# EAGLE design STM8L-FOX_80m_PA_V5_3 (EAGLE 7.7.0)
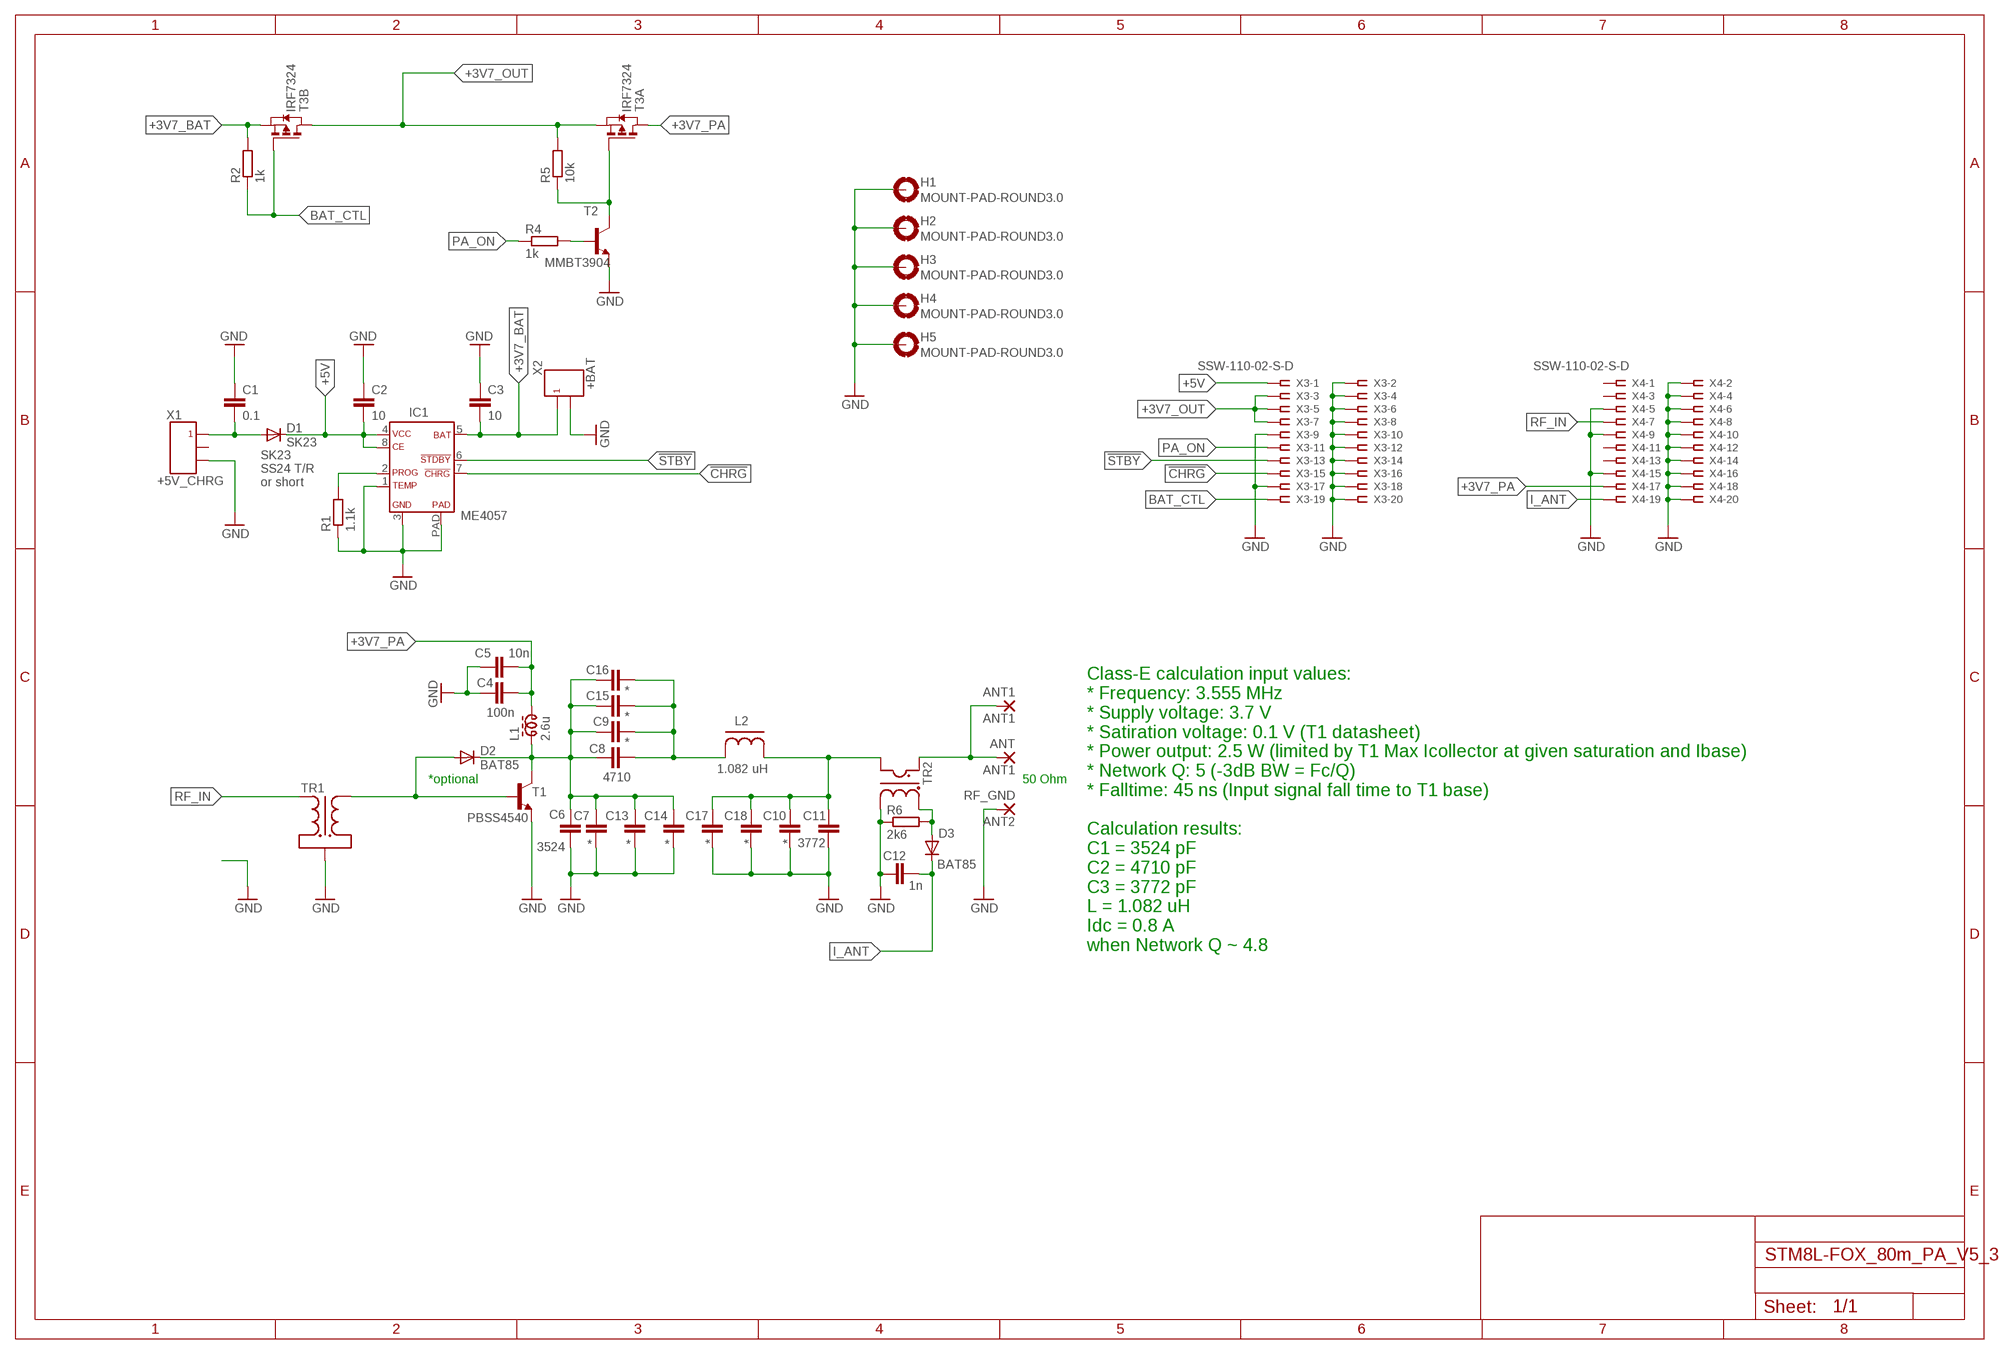
[diagram p0: schematic, sheet 1]

## Parts
ANT  ANT1  WIREPAD2,54/0,8  [2,54/0,8]
ANT1  ANT1  WIREPAD2,54/0,8  [2,54/0,8]
C1  0.1  C-EUC1206K  [C1206K]
C2  10  C-EUC1206K  [C1206K]
C3  10  C-EUC1206K  [C1206K]
C4  100n  C-EUC1206K  [C1206K]
C5  10n  C-EUC1206K  [C1206K]
C6  3524  C-EUC1206K  [C1206K]
C7  *  C-EUC1206K  [C1206K]
C8  4710  C-EUC1206K  [C1206K]
C9  *  C-EUC1206K  [C1206K]
C10  *  C-EUC1206K  [C1206K]
C11  3772  C-EUC1206K  [C1206K]
C12  1n  C-EUC1206K  [C1206K]
C13  *  C-EUC1206K  [C1206K]
C14  *  C-EUC1206K  [C1206K]
C15  *  C-EUC1206K  [C1206K]
C16  *  C-EUC1206K  [C1206K]
C17  *  C-EUC1206K  [C1206K]
C18  *  C-EUC1206K  [C1206K]
D1  SK23  DIODE-DO-214AC  [DO-214AC]
D2  BAT85  BAT81  [DO34-7]
D3  BAT85  BAT81  [DO34-7]
H1  MOUNT-PAD-ROUND3.0  [3,0-PAD]
H2  MOUNT-PAD-ROUND3.0  [3,0-PAD]
H3  MOUNT-PAD-ROUND3.0  [3,0-PAD]
H4  MOUNT-PAD-ROUND3.0  [3,0-PAD]
H5  MOUNT-PAD-ROUND3.0  [3,0-PAD]
IC1  ME4057A  ME4057  [SOP08-PP]
L1  2.6u  ZD60820513  [ZD6-3W]
L2  1.082 uH  T68_COIL  [T68_COIL]
R1  1.1k  R-EU_R1206  [R1206]
R2  1k  R-EU_R1206  [R1206]
R4  1k  R-EU_R1206  [R1206]
R5  10k  R-EU_R1206  [R1206]
R6  2k6  R-EU_R1206  [R1206]
RF_GND  ANT2  WIREPAD2,54/0,8  [2,54/0,8]
T1  PBSS4540  [SOT223]
T2  MMBT3904  MMBT3904LT1-NPN-SOT23-BEC  [SOT23-BEC]
T3  IRF7324  PMOS2SO8  [SO8]
TR1  K7X4X2_TRANS_1V1  [K7X4X2_TRANS_1V1]
TR2  K7X4X2_TRANS_CURRENT  [K7X4X2_TRANS_CURRENT]
X1  +5V_CHRG  A2501WR-3P  [A2501WR-3P]
X2  +BAT  A2501WR-2P  [A2501WR-2P]
X3  SSW-110-02-S-D  [SSW-110-02-S-D]
X4  SSW-110-02-S-D  [SSW-110-02-S-D]

## Nets
!CHRG!: IC1.7 X3.15
!STBY!: IC1.6 X3.13
+3V7_BAT: C3.2 IC1.5 R2.2 T3.3(B:S) X2.P$1
+3V7_OUT: R5.2 T3.1(A:S) T3.5(B:D) T3.6(B:D) X3.3 X3.5 X3.7
+3V7_PA: C4.2 C5.1 L1.2 T3.7(A:D) T3.8(A:D) X4.17
+5V: C2.2 D1.C IC1.4 IC1.8 X3.1
BAT_CTL: R2.1 T3.4(B:G) X3.19
CHRGR: C1.2 D1.A X1.P$1
GND: C1.1 C2.1 C3.1 C4.1 C5.2 C6.2 C7.2 C10.2 C11.2 C12.1 C13.2 C14.2 C17.2 C18.2 H1.B3,0(MOUNT) H2.B3,0(MOUNT) H3.B3,0(MOUNT) H4.B3,0(MOUNT) H5.B3,0(MOUNT) IC1.1 IC1.3 IC1.PAD R1.1 R6.1 RF_GND.1(P) T1.3(E) T2.E TR1.P$1 TR2.P$4 X1.P$3 X2.P$2 X3.2 X3.4 X3.6 X3.8 X3.9 X3.10 X3.12 X3.14 X3.16 X3.17 X3.18 X3.20 X4.2 X4.4 X4.5 X4.6 X4.8 X4.9 X4.10 X4.12 X4.14 X4.15 X4.16 X4.18 X4.20
I_ANT: C12.2 D3.C X4.19
N$1: D2.A T1.1(B) TR1.P$3
N$2: R5.1 T2.C T3.2(A:G)
N$3: C8.2 C9.2 C15.2 C16.2 L2.P$1
N$4: IC1.2 R1.2
N$5: R4.2 T2.B
N$7: C6.1 C7.1 C8.1 C9.1 C13.1 C14.1 C15.1 C16.1 D2.C L1.1 T1.2(C) T1.4(C)
N$8: C10.1 C11.1 C17.1 C18.1 L2.P$2 TR2.P$2
N$9: ANT1.1(P) ANT.1(P) TR2.P$1
N$11: D3.A R6.2 TR2.P$3
PA_ON: R4.1 X3.11
RF_IN: TR1.P$2 X4.7
Unconnected: L2.P$3 L2.P$4 TR1.P$4 TR1.P$5 X1.P$2 X4.1 X4.3 X4.11 X4.13

## Notes on the sheet
- SK23
  SS24 T/R
  or short
- *optional | 50 Ohm
- Class-E calculation input values:
  * Frequency: 3.555 MHz
  * Supply voltage: 3.7 V
  * Satiration voltage: 0.1 V (T1 datasheet)
  * Power output: 2.5 W (limited by T1 Max Icollector at given saturation and Ibase)
  * Network Q: 5 (-3dB BW = Fc/Q)
  * Falltime: 45 ns (Input signal fall time to T1 base)
  
  Calculation results:
  C1 = 3524 pF
  C2 = 4710 pF
  C3 = 3772 pF
  L = 1.082 uH
  Idc = 0.8 A
  when Network Q ~ 4.8

## Library data of the parts
ANT ANT1 RF_GND = wirepad:WIREPAD: Wire PAD connect wire on PCB
C1-C18 = rcl:C-EU: CAPACITOR, European symbol
D1 = diode:DIODE-: DIODE
D2 D3 = diode:BAT81: DIODE barrier diode
H1-H5 = holes:MOUNT-PAD-ROUND: MOUNTING PAD, round
IC1 = pa-ind:ME4057: ME4057 single cell LiPo charger
L1 = inductor-neosid:ZD60820513: WIDE-BAND CHOKE 3 windings; OC_FARNELL: unknown; OC_NEWARK: unknown
L2 = pa-ind:T68_COIL: Amidon T68 coil
R1 R2 R4-R6 = rcl:R-EU_: RESISTOR, European symbol
T1 = pa-ind:PBSS4540: PBSS4540 NPN BISS transistor SOT223
T2 = transistor:*-NPN-: NPN Transistror BF959 corrected 2008.03.06
T3 = zetex:PMOS2: DUAL 30V P-CHANNEL ENHANCEMENT MODE MOSFET Source: Data sheet <http://www.diodes.com/datasheets/ZXMP3A16DN8.pdf> SOP8 Source: Data sheet <http://www.diodes.com/datasheets/ZXMD63P03X.pdf> MSOP8; OC_FARNELL: unknown; OC_NEWARK: unknown
TR1 = pa-ind:K7X4X2_TRANS_1V1: K7x4x2 1:1 transformer
TR2 = pa-ind:K7X4X2_TRANS_CURRENT: K7x4x2 current transformer
X1 = pa-ind:A2501WR-3P: Joint Tech A2501 Series 3-pin 2.5 mm right angle through hole header.
X2 = pa-ind:A2501WR-2P
X3 X4 = con-samtec:SSW-110-02-S-D: THROUGH-HOLE .025" SQ POST SOCKET Source: Samtec SSW.pdf; MPN: SSW-110-02-S-D; OC_FARNELL: unknown; OC_NEWARK: 11P9480

## Board
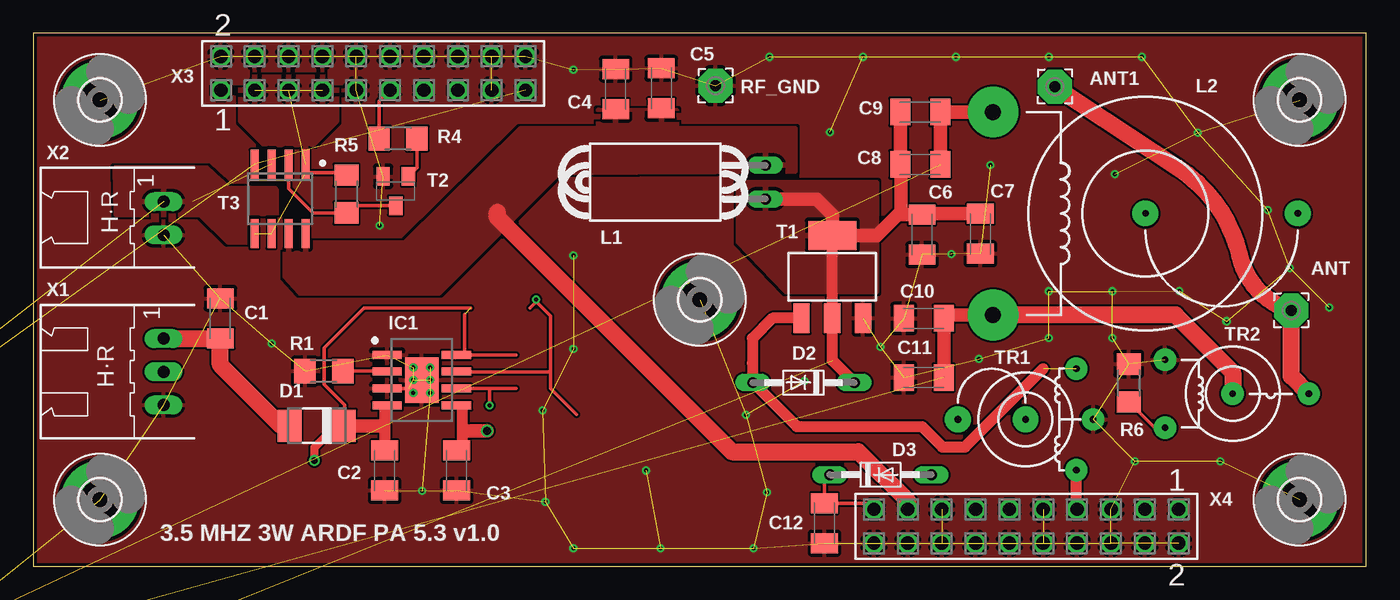
[diagram p1: board, top side]
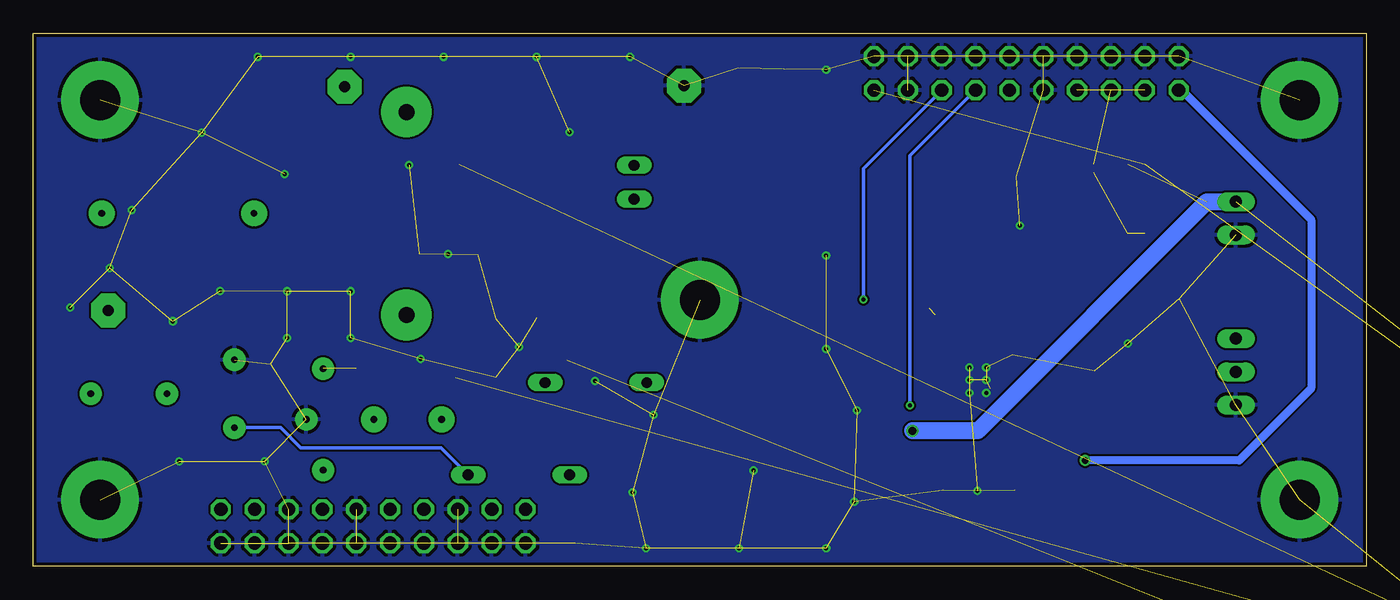
[diagram p2: board, bottom side, seen from below]

Size 100 x 40 mm. Coordinates in mm from the lower left corner, seen from the top.
Outline: 0,0 100,0 100,40 0,40 0,0
Copper layers (1*16): Top 0.035mm / dielectric 1.5mm / Bottom 0.035mm
Design rules "SeeedStudio_2layer_DRU_no_angle_20140221 *": minimum track width 6mil, minimum drill 0.29971875mm, track to track 6mil, track to pad 6mil, pad to pad 6mil, via to via 6mil, smd to smd 0mil, copper to edge 10mil, drill to drill 10mil, minimum pad ring 10mil, minimum via ring 6mil, stop-mask expansion 2mil, vias tented up to drill 100mil, thermal gap 10mil

### Footprints (pad centres in the part's own frame; a part is rotated, then mirrored left to right if it is on the bottom)
2,54/0,8 = drill 0.813 pad 2.54 octagon: 1 0,0
C1206K = smd 1.5 x 2: 1 -1.5,0; 2 1.5,0
DO-214AC = smd 1.8 x 2.4: A 2.025,0; C -2.025,0
DO34-7 = drill 0.813 long: A 3.81,0; C -3.81,0
3,0-PAD = drill 3 pad 5.842: B3,0 0,0
SOP08-PP = smd 0.6 x 2.2: 1 -1.905,-2.6; 2 -0.635,-2.6; 3 0.635,-2.6; 4 1.905,-2.6; 5 1.905,2.6; 6 0.635,2.6; 7 -0.635,2.6; 8 -1.905,2.6 | smd 3.404 x 2.515: PAD 0,0
ZD6-3W = drill 0.8 long: 1 -8.255,1.27; 2 -8.255,-1.27
T68_COIL = drill 1.2 pad 3.81: P$1 -7.62,-11.43; P$2 7.62,-11.43 | drill 0.5 pad 1.93: P$3 0,0; P$4 0,11.43
R1206 = smd 1.6 x 1.803: 1 -1.422,0; 2 1.422,0
SOT223 = smd 1.219 x 2.235: 1 -2.311,-3.099; 2 0,-3.099; 3 2.311,-3.099 | smd 3.6 x 2.2: 4 0,3.099
SOT23-BEC = smd 1 x 1.4: B -0.95,-1.1; C 0,1.1; E 0.95,-1.1
SO8 = smd 0.6 x 2.2: 1 -1.905,-2.6; 2 -0.635,-2.6; 3 0.635,-2.6; 4 1.905,-2.6; 5 1.905,2.6; 6 0.635,2.6; 7 -0.635,2.6; 8 -1.905,2.6
K7X4X2_TRANS_1V1 = drill 0.5 pad 1.676: P$1 0,-5.08; P$2 -3.81,-3.81; P$3 3.81,-3.81 | drill 0.5 pad 1.93: P$4 0,0; P$5 0,5.08
K7X4X2_TRANS_CURRENT = drill 0.5 pad 1.676: P$1 0,5.715; P$2 0,0; P$3 2.54,-5.08; P$4 -2.54,-5.08
A2501WR-3P = drill 0.9 long: P$1 7.5,2.3; P$2 5,2.3; P$3 2.5,2.3
A2501WR-2P = drill 0.9 long: P$1 4.95,2.3; P$2 2.45,2.3
SSW-110-02-S-D = drill 1 pad 1.5 octagon: 1 -11.43,-1.27; 2 -11.43,1.27; 3 -8.89,-1.27; 4 -8.89,1.27; 5 -6.35,-1.27; 6 -6.35,1.27; 7 -3.81,-1.27; 8 -3.81,1.27; 9 -1.27,-1.27; 10 -1.27,1.27; 11 1.27,-1.27; 12 1.27,1.27; 13 3.81,-1.27; 14 3.81,1.27; 15 6.35,-1.27; 16 6.35,1.27; 17 8.89,-1.27; 18 8.89,1.27; 19 11.43,-1.27; 20 11.43,1.27

### Placement (x,y rotation side)
ANT  94.37,19.2 0 top
ANT1  76.65,36 0 top
C1  14.03,18.61 270 top
C2  26.35,7.18 90 top
C3  31.75,7.18 90 top
C4  43.69,35.81 270 top
C5  47.12,35.88 90 top
C6  66.67,24.89 270 top
C7  71.06,24.96 270 top
C8  66.55,30.16 0 top
C9  66.55,34.1 0 top
C10  66.8,18.61 180 top
C11  66.8,14.16 180 top
C12  59.35,3.24 90 top
C13  -28.6,-20.85 0 top  (outside the outline)
C14  -35.3,-20.85 0 top  (outside the outline)
C15  -42,-20.85 0 top  (outside the outline)
C16  -48.7,-20.85 0 top  (outside the outline)
C17  -55.4,-20.85 0 top  (outside the outline)
C18  -62.1,-20.85 0 top  (outside the outline)
D1  21.27,10.54 180 top
D2  57.78,13.78 180 top
D3  63.57,6.87 0 top
H1  5,35 0 top
H2  95,35 0 top
H3  5,5 0 top
H4  95,5 0 top
H5  50,20 0 top
IC1  29.15,13.97 270 top
L1  46.67,28.83 180 top
L2  83.44,26.48 270 top
R1  21.8,14.64 0 top
R2  -61.9,-27.25 0 top  (outside the outline)
R4  27.36,32.1 0 top
R5  23.5,27.94 90 top
R6  82.19,13.75 270 top
RF_GND  51.18,36.07 0 top
T1  59.94,21.72 0 top
T2  27.19,28.16 180 top
T3  18.51,27.56 180 top
TR1  74.44,11.02 90 top
TR2  89.98,12.95 270 top
X1  12.06,9.59 90 top
X2  12.06,22.42 90 top
X3  25.5,37 0 top
X4  74.5,3 180 top

### Tracks (layer width: path | path; a pad name or v marks a point on that pad's centre or on a via)
!CHRG!  (via drill 0.3)
  Top 0.254: IC1.7 38.8,14.6 | 37.27,19.37 37.72,19.82 v37.72,20.01 37.72,19.88 38.8,18.8 38.8,14.6 | 40.75,11.4 38.8,13.35 38.8,14.6
  Bottom 0.254: X3.15 37.72,29.86 v37.72,20.01
!STBY!  (via drill 0.3)
  Top 0.254: IC1.6 34.2,13.34 | 34.2,13.34 36.23,13.34 | v34.23,12.06 34.23,13.31 34.2,13.34
  Bottom 0.254: v34.23,12.06 34.23,30.81 X3.13
+3V7_BAT  (via drill 0.6)  (2 unrouted)
  Top 0.254: 32.19,11.75 31.88,12.06 IC1.5 | 32.7,10.16 32.19,10.16
  Top 0.813: C3.2 32.19,9.13 32.19,10.16 32.19,11.75
  Top 1.016: v34.04,10.16 32.7,10.16
  Bottom 1.27: v34.04,10.16 29.15,10.16 11.94,27.37 X2.P$1
  pour Top (isolate 0.254): 18.2,28.25 18.2,24.3 14.65,24.35 12.55,26.4 6.2,26.4 6.15,29.9 13,29.9 14.05,28.9 14.6,28.35 18.15,28.35
+3V7_OUT  (5 unrouted)
  Top 0.254: R5.2 23.31,29.55 20.45,29.55 20.45,30.13 T3.1
  pour Top (isolate 0.254): 15.55,36.7 15.55,33.45 17.5,31.5 17.5,30.75 20.8,30.75 20.8,31.5 22.75,33.45 22.75,36.7
+3V7_PA
  Top 1.27: X4.17 65.61,4.89 61.9,8.6 52.4,8.6 34.8,26.2 34.8,26.55
  pour Top (isolate 0.254): 18.9,24.25 27.9,24.25 36.6,32.85 42.4,32.85 42.4,34.25 48.25,34.2 48.25,32.85 57.15,32.85 57.15,29.65 39.4,29.55 30.4,20.5 20,20.5 18.9,21.75
+5V  (via drill 0.5)  (1 unrouted)
  Top 0.254: 26.38,11.89 IC1.4 | 26.25,10.54 26.38,10.54 | IC1.8 32.35,15.88 | 32.35,15.88 36.23,15.88 | 32.35,18.91 32.35,15.88 | 32.81,19.4 24.8,19.4 21.8,16.4 21.8,13.65 23.35,12.1 23.35,10.85 23.3,10.85 D1.C
  Top 0.406: 26.38,8.7 C2.2
  Top 0.61: v21.08,7.94 21.08,8.89 22.73,10.54 D1.C
  Top 0.813: 26.38,8.7 26.38,10.54 26.38,11.89
  Top 1.016: D1.C 26.25,10.54
  Bottom 0.61: v21.08,7.94 9.53,7.94 4.13,13.34 4.13,26.04 13.82,35.73 X3.1
BAT_CTL  (2 unrouted)
CHRGR
  Top 1.27: X1.P$1 9.78,17.11 C1.2 14.03,15.11 18.61,10.54 D1.A
GND  (via drill 0.3)  (98 unrouted)
  Top 0.254: IC1.3 28.19,13.34 v28.51,13.02
  other vias: 28.51,14.92 28.51,13.97 29.78,14.92 29.78,13.97 29.78,13.02 38.2,11.71 40.51,37.27 40.51,23.3 40.51,16.32 38.41,4.83 59.75,32.58 53.47,11.37 57.85,13.91 68.9,23.43 63.56,16.45 45.97,7.18 25.98,25.57 55.04,5.55 17.89,16.71 71.82,30.1 76.2,20.64 80.96,20.64 89.53,18.39 70.93,15.56 82.64,7.85 76.2,17.14 80.96,17.14 89.05,7.86 85.97,20.64 29.16,5.64 97.24,19.43 94.27,22.38 54.04,1.33 47.05,1.33 40.51,1.33 62.23,38.23 55.24,38.23 69.22,38.23 76.2,38.23 83.19,38.23 81.14,29.44 92.64,26.74 87.39,32.54
  pour Top (rank 2): -0.64,40.64 102.23,40.64 101.89,-5.13 -0.98,-5.13
  pour Bottom: -1.14,41.27 102.93,41.34 103.46,-1.95 -1.25,-1.82
I_ANT
  Top 0.254: X4.19 62.6,4.74 C12.2 59.35,6.46 D3.C
N$1  (1 unrouted)
  Top 0.813: 75.78,14.83 69.9,8.95 68.2,8.95 66.67,10.48 57.28,10.48 D2.A 53.98,15.21 53.95,15.24 53.95,17.1 55.47,18.62 T1.1
N$2
  Top 0.254: T2.C 24.04,27.06 R5.1 20.98,26.52 19.14,28.36 T3.2
  Top 0.305: 23.5,26.54 R5.1
N$3  (2 unrouted)
  Top 1.016: C8.2 C9.2 L2.P$1
N$4
  Top 0.254: R1.2 26.55,14.64 IC1.2
N$5
  Top 0.254: T2.B 28.79,29.9 R4.2
N$7  (4 unrouted)
  Top 0.813: D2.C 59.94,15.43 T1.2 T1.4
  Top 1.016: C7.1 66.74,26.46 C6.1 65.09,26.39 | 65.09,26.39 64.87,26.39 63.3,24.82 T1.4 | 59.7,24.83 T1.4 | C9.1 C8.1 65.09,30.12 65.09,26.39 | L1.1 58.74,27.56 59.94,26.35 T1.4 | 59.63,24.88 T1.4
  pour Top: 63.25,28.79 63.25,20.64 56.5,20.6 52.9,24.35 52.89,28.79
N$8  (2 unrouted)
  Top 1.016: C11.1 C10.1 68.56,18.86 L2.P$2
  Top 1.27: L2.P$2 85.68,18.86 89.98,14.56 TR2.P$2
N$9
  Top 1.27: TR2.P$1 94.37,14.28 ANT.1 arc-60 90.5,23.3 arc43 85.9,29.9 ANT1.1
N$11
  Top 0.254: R6.2 84.11,10.41 TR2.P$3
  Bottom 0.254: D3.A 69.41,8.9 79.95,8.9 81.46,10.41 TR2.P$3
PA_ON
  Top 0.254: R4.1 25.94,34.9 X3.11
RF_IN
  Top 0.813: X4.7 78.25,4.33 TR1.P$2

### Text on the board
tPlace: 3.5 MHZ 3W ARDF PA 5.3 v1.0